# Altium project XLR8_Fast_line_following_robot.PrjPcb
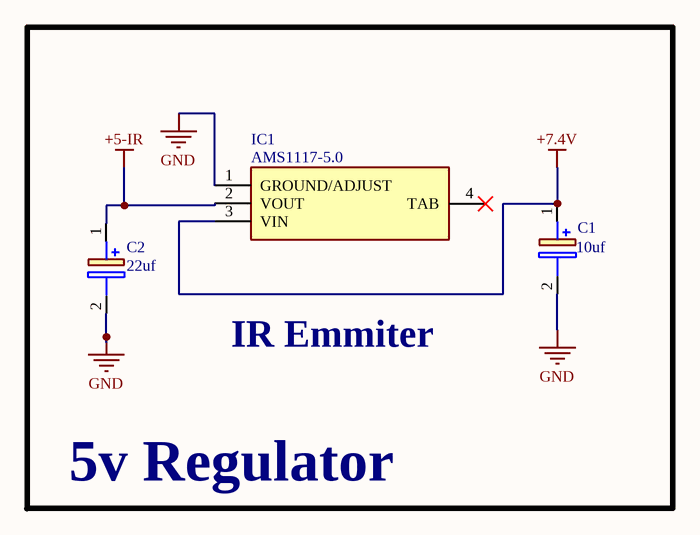
[diagram p0: Power.SchDoc]
2 sheets, 67 parts. Net scope: flat (ports and power ports of the same name join across sheets).
Board file: XLR8_pcb.PcbDoc
Sheets:
  Power.SchDoc
  IR_array.SchDoc

## Sheet Power.SchDoc
size A4; SheetNumber: 2; SheetTotal: 4

### Parts
C1  Capacitance: 10uf  [T491A]  (hidden comment: T491A106K006AT7280)
C2  Capacitance: 22uf  [CAPPM3216X180N]  (hidden comment: F931C226MAAAJ6)
IC1  AMS1117-5.0  [SOT229P700X180-4N]

### Blocks framed on the sheet
5v Regulator: C1 C2 IC1

### Nets
+5-IR: C2.1(+) IC1.2(VOUT)
+7.4V: C1.1(+) IC1.3(VIN)
GND: C1.2(-) C2.2(-) IC1.1(GROUND/ADJUST)

Not connected (* = marked no-connect by the designer): IC1 4(TAB)*

### Notes on the sheet
- IR Emmiter
- Title:
- Auther:
- L.H.H.Maduwantha
- Size:
- A4
- Date:
- File:
- Time:
- Sheet
- Of

### Library data of the parts
C1 = T491A106K006AT7280: Capacitor Polarised; Manufacturer_Name: KEMET; Datasheet Link: https://content.kemet.com/datasheets/KEM_T2005_T491.pdf; Height: 1.8mm; Manufacturer_Part_Number: T491A106K006AT7280; Mouser Part Number: 80-T491A106K0067280; Mouser Price/Stock: https://www.mouser.co.uk/ProductDetail/KEMET/T491A106K006AT7280?qs=EtU2D%2FqTXbN9MxxgrIrCXA%3D%3D; Arrow Part Number: T491A106K006AT7280; Arrow Price/Stock: https://www.arrow.com/en/products/t491a106k006at7280/kemet-corporation?region=nac
C2 = F931C226MAAAJ6: Capacitor Polarised; Manufacturer_Name: Kyocera AVX; Datasheet Link: https://datasheet.datasheetarchive.com/originals/distributors/Datasheets_SAMA/dc9a3b3d744ab3693b5a12837d30b034.pdf; Height: 1.8mm; Manufacturer_Part_Number: F931C226MAAAJ6; Mouser Part Number: 581-F931C226MAAAJ6; Mouser Price/Stock: https://www.mouser.co.uk/ProductDetail/AVX/F931C226MAAAJ6?qs=5aG0NVq1C4wg0PYYXTBb0Q%3D%3D; Arrow Part Number: F931C226MAAAJ6; Arrow Price/Stock: https://www.arrow.com/en/products/f931c226maaaj6/avx
IC1 = AMS1117-5.0: Integrated Circuit; Manufacturer_Name: Advanced Monolithic Systems; Datasheet Link: http://www.advanced-monolithic.com/pdf/ds1117.pdf; Height: 1.8mm; Manufacturer_Part_Number: AMS1117-5.0

## Sheet IR_array.SchDoc
size A4; SheetNumber: 4; SheetTotal: 5
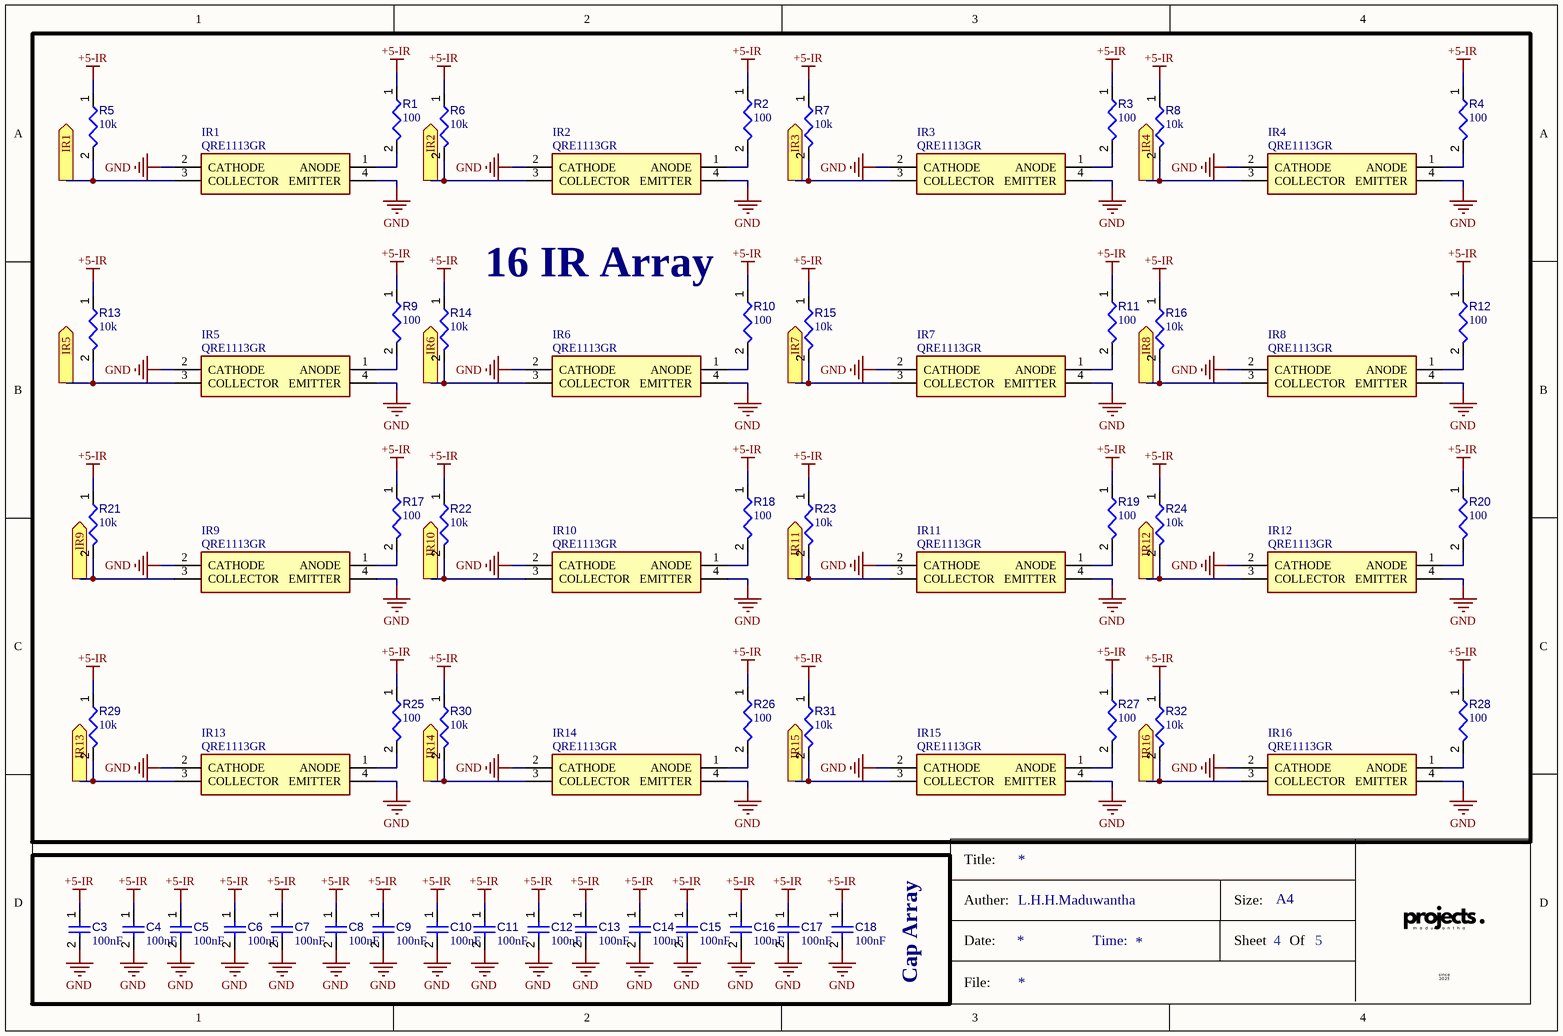
[diagram p1: IR_array.SchDoc]

### Parts
C3  value 100nF  [CAPC2013X95X50LL10T25]  (hidden comment: Capacitor 100 nF +/-10% 50 V 0805)
C4  value 100nF  [CAPC2013X95X50LL10T25]  (hidden comment: Capacitor 100 nF +/-10% 50 V 0805)
C5  value 100nF  [CAPC2013X95X50LL10T25]  (hidden comment: Capacitor 100 nF +/-10% 50 V 0805)
C6  value 100nF  [CAPC2013X95X50LL10T25]  (hidden comment: Capacitor 100 nF +/-10% 50 V 0805)
C7  value 100nF  [CAPC2013X95X50LL10T25]  (hidden comment: Capacitor 100 nF +/-10% 50 V 0805)
C8  value 100nF  [CAPC2013X95X50LL10T25]  (hidden comment: Capacitor 100 nF +/-10% 50 V 0805)
C9  value 100nF  [CAPC2013X95X50LL10T25]  (hidden comment: Capacitor 100 nF +/-10% 50 V 0805)
C10  value 100nF  [CAPC2013X95X50LL10T25]  (hidden comment: Capacitor 100 nF +/-10% 50 V 0805)
C11  value 100nF  [CAPC2013X95X50LL10T25]  (hidden comment: Capacitor 100 nF +/-10% 50 V 0805)
C12  value 100nF  [CAPC2013X95X50LL10T25]  (hidden comment: Capacitor 100 nF +/-10% 50 V 0805)
C13  value 100nF  [CAPC2013X95X50LL10T25]  (hidden comment: Capacitor 100 nF +/-10% 50 V 0805)
C14  value 100nF  [CAPC2013X95X50LL10T25]  (hidden comment: Capacitor 100 nF +/-10% 50 V 0805)
C15  value 100nF  [CAPC2013X95X50LL10T25]  (hidden comment: Capacitor 100 nF +/-10% 50 V 0805)
C16  value 100nF  [CAPC2013X95X50LL10T25]  (hidden comment: Capacitor 100 nF +/-10% 50 V 0805)
C17  value 100nF  [CAPC2013X95X50LL10T25]  (hidden comment: Capacitor 100 nF +/-10% 50 V 0805)
C18  value 100nF  [CAPC2013X95X50LL10T25]  (hidden comment: Capacitor 100 nF +/-10% 50 V 0805)
IR1  QRE1113GR  [QRE1113GR]
IR2  QRE1113GR  [QRE1113GR]
IR3  QRE1113GR  [QRE1113GR]
IR4  QRE1113GR  [QRE1113GR]
IR5  QRE1113GR  [QRE1113GR]
IR6  QRE1113GR  [QRE1113GR]
IR7  QRE1113GR  [QRE1113GR]
IR8  QRE1113GR  [QRE1113GR]
IR9  QRE1113GR  [QRE1113GR]
IR10  QRE1113GR  [QRE1113GR]
IR11  QRE1113GR  [QRE1113GR]
IR12  QRE1113GR  [QRE1113GR]
IR13  QRE1113GR  [QRE1113GR]
IR14  QRE1113GR  [QRE1113GR]
IR15  QRE1113GR  [QRE1113GR]
IR16  QRE1113GR  [QRE1113GR]
R1  value 100  [RESC2013X70X40ML20T20]  (hidden comment: Resistor 100k +/-1% 0805 125 mW)
R2  value 100  [RESC2013X70X40ML20T20]  (hidden comment: Resistor 100k +/-1% 0805 125 mW)
R3  value 100  [RESC2013X70X40ML20T20]  (hidden comment: Resistor 100k +/-1% 0805 125 mW)
R4  value 100  [RESC2013X70X40ML20T20]  (hidden comment: Resistor 100k +/-1% 0805 125 mW)
R5  value 10k  [RESC2013X50X35ML15T15]  (hidden comment: Resistor 10k +/-1% 0805 125 mW)
R6  value 10k  [RESC2013X50X35ML15T15]  (hidden comment: Resistor 10k +/-1% 0805 125 mW)
R7  value 10k  [RESC2013X50X35ML15T15]  (hidden comment: Resistor 10k +/-1% 0805 125 mW)
R8  value 10k  [RESC2013X50X35ML15T15]  (hidden comment: Resistor 10k +/-1% 0805 125 mW)
R9  value 100  [RESC2013X70X40ML20T20]  (hidden comment: Resistor 100k +/-1% 0805 125 mW)
R10  value 100  [RESC2013X70X40ML20T20]  (hidden comment: Resistor 100k +/-1% 0805 125 mW)
R11  value 100  [RESC2013X70X40ML20T20]  (hidden comment: Resistor 100k +/-1% 0805 125 mW)
R12  value 100  [RESC2013X70X40ML20T20]  (hidden comment: Resistor 100k +/-1% 0805 125 mW)
R13  value 10k  [RESC2013X50X35ML15T15]  (hidden comment: Resistor 10k +/-1% 0805 125 mW)
R14  value 10k  [RESC2013X50X35ML15T15]  (hidden comment: Resistor 10k +/-1% 0805 125 mW)
R15  value 10k  [RESC2013X50X35ML15T15]  (hidden comment: Resistor 10k +/-1% 0805 125 mW)
R16  value 10k  [RESC2013X50X35ML15T15]  (hidden comment: Resistor 10k +/-1% 0805 125 mW)
R17  value 100  [RESC2013X70X40ML20T20]  (hidden comment: Resistor 100k +/-1% 0805 125 mW)
R18  value 100  [RESC2013X70X40ML20T20]  (hidden comment: Resistor 100k +/-1% 0805 125 mW)
R19  value 100  [RESC2013X70X40ML20T20]  (hidden comment: Resistor 100k +/-1% 0805 125 mW)
R20  value 100  [RESC2013X70X40ML20T20]  (hidden comment: Resistor 100k +/-1% 0805 125 mW)
R21  value 10k  [RESC2013X50X35ML15T15]  (hidden comment: Resistor 10k +/-1% 0805 125 mW)
R22  value 10k  [RESC2013X50X35ML15T15]  (hidden comment: Resistor 10k +/-1% 0805 125 mW)
R23  value 10k  [RESC2013X50X35ML15T15]  (hidden comment: Resistor 10k +/-1% 0805 125 mW)
R24  value 10k  [RESC2013X50X35ML15T15]  (hidden comment: Resistor 10k +/-1% 0805 125 mW)
R25  value 100  [RESC2013X70X40ML20T20]  (hidden comment: Resistor 100k +/-1% 0805 125 mW)
R26  value 100  [RESC2013X70X40ML20T20]  (hidden comment: Resistor 100k +/-1% 0805 125 mW)
R27  value 100  [RESC2013X70X40ML20T20]  (hidden comment: Resistor 100k +/-1% 0805 125 mW)
R28  value 100  [RESC2013X70X40ML20T20]  (hidden comment: Resistor 100k +/-1% 0805 125 mW)
R29  value 10k  [RESC2013X50X35ML15T15]  (hidden comment: Resistor 10k +/-1% 0805 125 mW)
R30  value 10k  [RESC2013X50X35ML15T15]  (hidden comment: Resistor 10k +/-1% 0805 125 mW)
R31  value 10k  [RESC2013X50X35ML15T15]  (hidden comment: Resistor 10k +/-1% 0805 125 mW)
R32  value 10k  [RESC2013X50X35ML15T15]  (hidden comment: Resistor 10k +/-1% 0805 125 mW)

### Blocks framed on the sheet
16 IR Array: IR1-IR16 R1-R32
Cap Array: C3-C18

### Ports
IR1 (out, see Main[3B], Connectors[1A]), IR2 (out, see Main[3B], Connectors[1B]), IR3 (out, see Main[3B], Connectors[1B]), IR4 (out, see Main[3B], Connectors[1B]), IR5 (out, see Main[3B], Connectors[1B]), IR6 (out, see Main[3B], Connectors[1B]), IR7 (out, see Main[3B], Connectors[1B]), IR8 (out, see Main[3B], Connectors[1B]), IR9 (out, see Main[3B], Connectors[2A]), IR10 (out, see Main[3B], Connectors[2B]), IR11 (out, see Main[3B], Connectors[2B]), IR12 (out, see Main[3B], Connectors[2B]), IR13 (out, see Main[3B], Connectors[2B]), IR14 (out, see Main[3B], Connectors[2B]), IR15 (out, see Main[3B], Connectors[2B]), IR16 (out, see Main[3C], Connectors[2B])

### Nets
+5-IR: C3.1 C4.1 C5.1 C6.1 C7.1 C8.1 C9.1 C10.1 C11.1 C12.1 C13.1 C14.1 C15.1 C16.1 C17.1 C18.1 R1.1 R2.1 R3.1 R4.1 R5.1 R6.1 R7.1 R8.1 R9.1 R10.1 R11.1 R12.1 R13.1 R14.1 R15.1 R16.1 R17.1 R18.1 R19.1 R20.1 R21.1 R22.1 R23.1 R24.1 R25.1 R26.1 R27.1 R28.1 R29.1 R30.1 R31.1 R32.1
GND: C3.2 C4.2 C5.2 C6.2 C7.2 C8.2 C9.2 C10.2 C11.2 C12.2 C13.2 C14.2 C15.2 C16.2 C17.2 C18.2 IR1.2(CATHODE) IR1.4(EMITTER) IR2.2(CATHODE) IR2.4(EMITTER) IR3.2(CATHODE) IR3.4(EMITTER) IR4.2(CATHODE) IR4.4(EMITTER) IR5.2(CATHODE) IR5.4(EMITTER) IR6.2(CATHODE) IR6.4(EMITTER) IR7.2(CATHODE) IR7.4(EMITTER) IR8.2(CATHODE) IR8.4(EMITTER) IR9.2(CATHODE) IR9.4(EMITTER) IR10.2(CATHODE) IR10.4(EMITTER) IR11.2(CATHODE) IR11.4(EMITTER) IR12.2(CATHODE) IR12.4(EMITTER) IR13.2(CATHODE) IR13.4(EMITTER) IR14.2(CATHODE) IR14.4(EMITTER) IR15.2(CATHODE) IR15.4(EMITTER) IR16.2(CATHODE) IR16.4(EMITTER)
NetIR1_1: IR1.1(ANODE) R1.2
NetIR1_3: IR1.3(COLLECTOR) R5.2 ; port IR1
NetIR2_1: IR2.1(ANODE) R2.2
NetIR2_3: IR2.3(COLLECTOR) R6.2 ; port IR2
NetIR3_1: IR3.1(ANODE) R3.2
NetIR3_3: IR3.3(COLLECTOR) R7.2 ; port IR3
NetIR4_1: IR4.1(ANODE) R4.2
NetIR4_3: IR4.3(COLLECTOR) R8.2 ; port IR4
NetIR5_1: IR5.1(ANODE) R9.2
NetIR5_3: IR5.3(COLLECTOR) R13.2 ; port IR5
NetIR6_1: IR6.1(ANODE) R10.2
NetIR6_3: IR6.3(COLLECTOR) R14.2 ; port IR6
NetIR7_1: IR7.1(ANODE) R11.2
NetIR7_3: IR7.3(COLLECTOR) R15.2 ; port IR7
NetIR8_1: IR8.1(ANODE) R12.2
NetIR8_3: IR8.3(COLLECTOR) R16.2 ; port IR8
NetIR9_1: IR9.1(ANODE) R17.2
NetIR9_3: IR9.3(COLLECTOR) R21.2 ; port IR9
NetIR10_1: IR10.1(ANODE) R18.2
NetIR10_3: IR10.3(COLLECTOR) R22.2 ; port IR10
NetIR11_1: IR11.1(ANODE) R19.2
NetIR11_3: IR11.3(COLLECTOR) R23.2 ; port IR11
NetIR12_1: IR12.1(ANODE) R20.2
NetIR12_3: IR12.3(COLLECTOR) R24.2 ; port IR12
NetIR13_1: IR13.1(ANODE) R25.2
NetIR13_3: IR13.3(COLLECTOR) R29.2 ; port IR13
NetIR14_1: IR14.1(ANODE) R26.2
NetIR14_3: IR14.3(COLLECTOR) R30.2 ; port IR14
NetIR15_1: IR15.1(ANODE) R27.2
NetIR15_3: IR15.3(COLLECTOR) R31.2 ; port IR15
NetIR16_1: IR16.1(ANODE) R28.2
NetIR16_3: IR16.3(COLLECTOR) R32.2 ; port IR16

### Notes on the sheet
- Title:
- Auther:
- L.H.H.Maduwantha
- Size:
- A4
- Date:
- File:
- Time:
- Sheet
- Of

### Library data of the parts
C3-C18 = CMP-001-00018-6: Chip Capacitor, 100 nF, +/- 10%, 50 V, 0805 (2012 Metric); Capacitor Type: Ceramic; Voltage Rating: 50V; Pins: 2; Max Operating Temperature: 125°C; Min Operating Temperature: -55°C; Mounting Technology: SM; Case/Package: 0805; RoHS Compliant: True; Tolerance: 10%
IR1-IR16 = QRE1113GR: Undefined or Miscellaneous; Manufacturer_Name: onsemi; Datasheet Link: http://www.onsemi.com/pub/Collateral/QRE1113-D.PDF; Manufacturer_Part_Number: QRE1113GR; Mouser Part Number: 512-QRE1113GR; Mouser Price/Stock: https://www.mouser.co.uk/ProductDetail/onsemi-Fairchild/QRE1113GR?qs=Qb0BA3xILekkPpSVC5x7uQ%3D%3D; Arrow Part Number: QRE1113GR; Arrow Price/Stock: https://www.arrow.com/en/products/qre1113gr/on-semiconductor?utm_currency=USD&region=europe
R1-R4 R9-R12 R17-R20 R25-R28 = CMP-009-00024-5: Chip Resistor, 100 KOhm, +/- 1%, 0.125 W, -55 to 155 degC, 0805 (2012 Metric); Power: 125mW; Voltage Rating: 150V; Max Operating Temperature: 155°C; Mounting Technology: SM; RoHS Compliant: True; Tolerance: 1%; Case/Package: 0805; Min Operating Temperature: -55°C; Pins: 2
R5-R8 R13-R16 R21-R24 R29-R32 = CMP-009-00018-5: Chip Resistor, 10 KOhm, +/- 1%, 125 mW, -55 to 155 degC, 0805 (2012 Metric); Power: 125mW; Voltage Rating: 150V; Tolerance: 1%; Pins: 2; Min Operating Temperature: -55°C; Case/Package: 0805; Max Operating Temperature: 155°C; RoHS Compliant: True; Mounting Technology: SM

## Nets that join several sheets
+5-IR: Power (C2.1 IC1.2), IR_array (48 pins)
GND: Power (C1.2 C2.2 IC1.1), IR_array (48 pins)